# Altium project CustomSTM32.PrjPcb
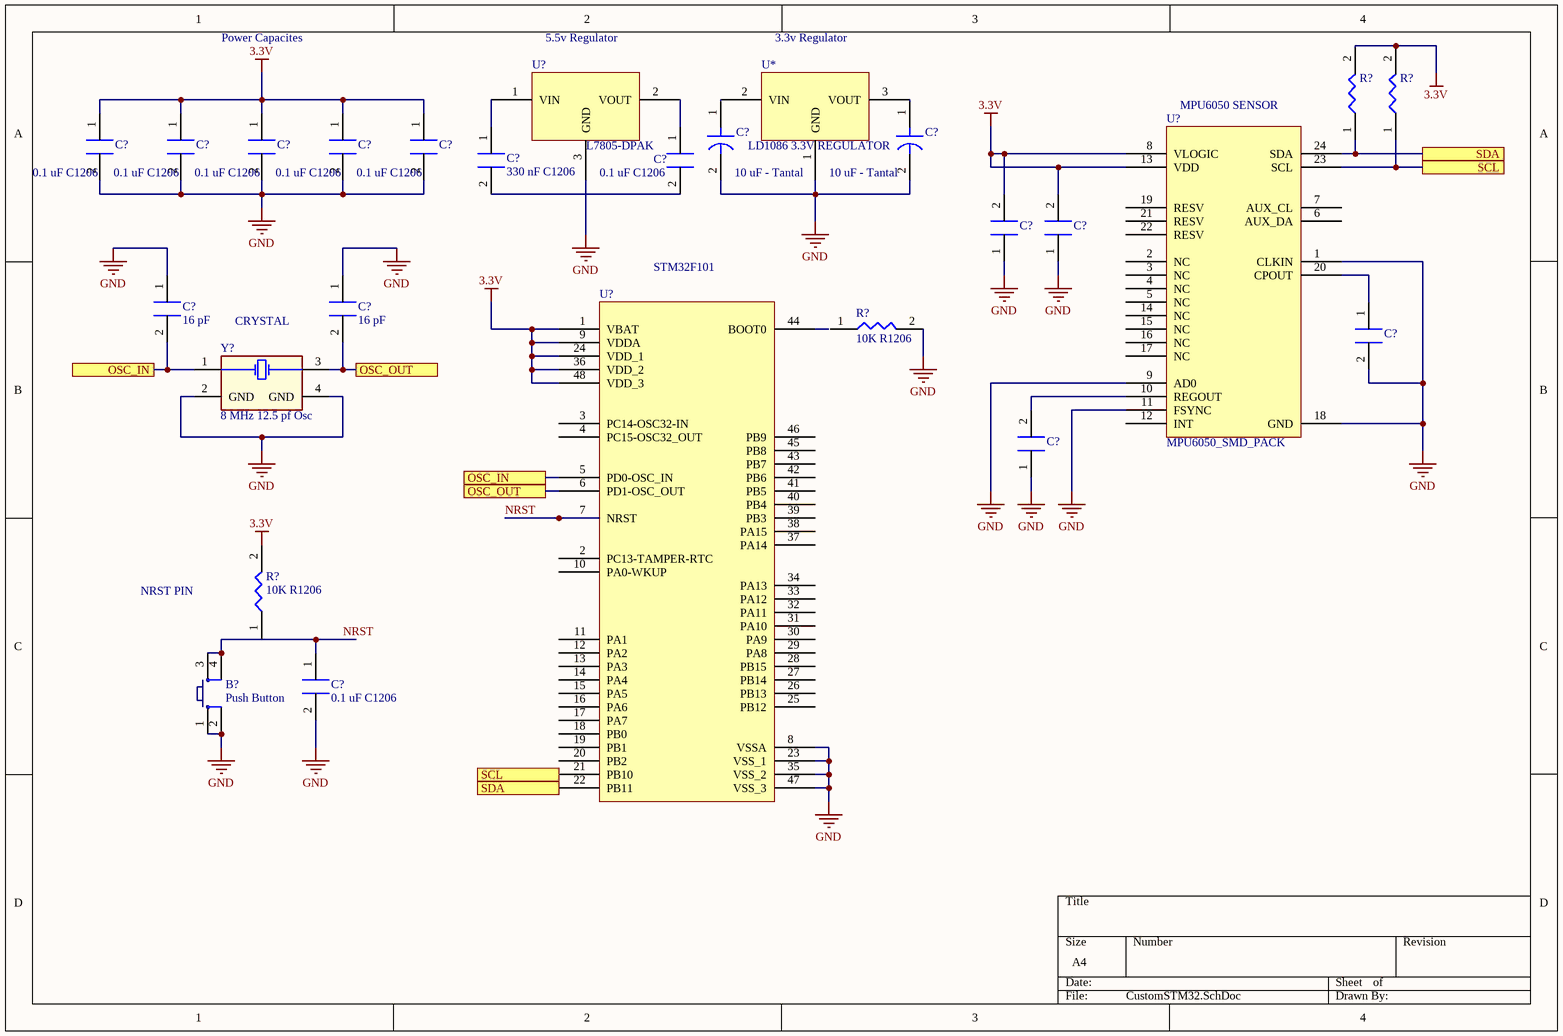
[diagram p0: CustomSTM32.SchDoc]
1 sheet, 26 parts. Net scope: flat (ports and power ports of the same name join across sheets).
Board file: CustomSTM32.PcbDoc

## Sheet CustomSTM32.SchDoc: STM32F1XX CUSTOM PCB
size A4

### Parts
(Parts that share a designator on the sheet are numbered #1, #2 ... from top to bottom, then left to right.)
B?  Push Button  [PUSB BUTTON-SMD]
C?#1  10 uF - Tantal  [C1206- TANTAL]
C?#2  10 uF - Tantal  [C1206- TANTAL]
C?#3  0.1 uF C1206  [C1206]
C?#4  0.1 uF C1206  [C1206]
C?#5  0.1 uF C1206  [C1206]
C?#6  0.1 uF C1206  [C1206]
C?#7  0.1 uF C1206  [C1206]
C?#8  330 nF C1206  [C1206]
C?#9  0.1 uF C1206  [C1206]
C?#10  0.1 uF C1206  [C1206]  (value not drawn)
C?#11  0.1 uF C1206  [C1206]  (value not drawn)
C?#12  16 pF  [C1206]
C?#13  16 pF  [C1206]
C?#14  2.2 nF Cap  [C1206]  (value not drawn)
C?#15  0.1 uF C1206  [C1206]  (value not drawn)
C?#16  0.1 uF C1206  [C1206]
R?#1  4.7K R1206  [R1206 Resıstor]  (value not drawn)
R?#2  4.7K R1206  [R1206 Resıstor]  (value not drawn)
R?#3  10K R1206  [R1206 Resıstor]
R?#4  10K R1206  [R1206 Resıstor]
U*  LD1086 3.3V REGULATOR  [DPAK228P972X230-3N]
U?#1  L7805-DPAK  [DPAK228P972X230-3N]
U?#2  MPU6050_SMD_PACK  [QFN50P400X400X95_HS-25N]
U?#3  STM32F101  [LQFP48-STM]
Y?  8 MHz 12.5 pf Osc  [8 MHZ Osc.]

### Ports
OSC_IN, OSC_OUT, SCL, SDA

### Nets
3.3V: C?#3.1 C?#4.1 C?#5.1 C?#6.1 C?#7.1 C?#10.2 C?#11.2 R?#1.2 R?#2.2 R?#4.2 U?#2.8(VLOGIC) U?#2.13(VDD) U?#3.1(VBAT) U?#3.9(VDDA) U?#3.24(VDD_1) U?#3.36(VDD_2) U?#3.48(VDD_3)
GND: B?.1 B?.2 C?#1.2 C?#2.2 C?#3.2 C?#4.2 C?#5.2 C?#6.2 C?#7.2 C?#10.1 C?#11.1 C?#12.1 C?#13.1 C?#14.2 C?#15.1 C?#16.2 R?#3.2 U*.1(GND) U?#1.3(GND) U?#2.1(CLKIN) U?#2.9(AD0) U?#2.11(FSYNC) U?#2.18(GND) U?#3.8(VSSA) U?#3.23(VSS_1) U?#3.35(VSS_2) U?#3.47(VSS_3) Y?.2(GND) Y?.4(GND)
NRST: B?.3 B?.4 C?#16.1 U?#3.7(NRST)
NetC?#1_1: C?#1.1 U*.2(VIN)
NetC?#2_1: C?#2.1 U*.3(VOUT)
NetC?#8_1: C?#8.1 U?#1.1(VIN)
NetC?#8_2: C?#8.2 C?#9.2
NetC?#9_1: C?#9.1 U?#1.2(VOUT)
NetC?#12_2: C?#12.2 U?#3.5(PD0-OSC_IN) Y?.1 ; port OSC_IN
NetC?#13_2: C?#13.2 U?#3.6(PD1-OSC_OUT) Y?.3 ; port OSC_OUT
NetC?#14_1: C?#14.1 U?#2.20(CPOUT)
NetC?#15_2: C?#15.2 U?#2.10(REGOUT)
NetR?#1_1: R?#1.1 U?#2.24(SDA) U?#3.22(PB11) ; port SDA
NetR?#2_1: R?#2.1 U?#2.23(SCL) U?#3.21(PB10) ; port SCL

Not connected (* = marked no-connect by the designer): R?#3 1; R?#4 1; U?#2 2(NC) 3(NC) 4(NC) 5(NC) 6(AUX_DA) 7(AUX_CL) 12(INT) 14(NC) 15(NC) 16(NC) 17(NC) 19(RESV) 21(RESV) 22(RESV); U?#3 2(PC13-TAMPER-RTC) 3(PC14-OSC32-IN) 4(PC15-OSC32_OUT) 10(PA0-WKUP) 11(PA1) 12(PA2) 13(PA3) 14(PA4) 15(PA5) 16(PA6) 17(PA7) 18(PB0) 19(PB1) 20(PB2) 25(PB12) 26(PB13) 27(PB14) 28(PB15) 29(PA8) 30(PA9) 31(PA10) 32(PA11) 33(PA12) 34(PA13) 37(PA14) 38(PA15) 39(PB3) 40(PB4) 41(PB5) 42(PB6) 43(PB7) 44(BOOT0) 45(PB8) 46(PB9)

### Notes on the sheet
- Power Capacites
- 5.5v Regulator
- 3.3v Regulator
- (near U?#2) MPU6050 SENSOR
- (near Y?) CRYSTAL
- NRST PIN

### Library data of the parts
B? = Push Button: Smd Push Button; Satın Alma Linki: https://urun.n11.com/diger/mini-pushbutton-switch-smd-P227461537?gclid=Cj0KCQjwkoDmBRCcARIsAG3xzl8Y_-jeD7HocNM6lvuZ_rVp83568XPGtNzlPwXWLph8oCRqo0yh87UaApZYEALw_wcB&gclsrc=aw.ds
U* = LD1086 3.3V REGULATOR: 3.3V REGULATOR
U?#1 = L7805-DPAK: L7805 5V REGULATOR SMD PACK
U?#2 = MPU6050_SMD_PACK: MPU6050_SENSOR
U?#3 = STM32F101: STM32F101 48 PIN MCUp